# Altium project oldman.PrjPCB
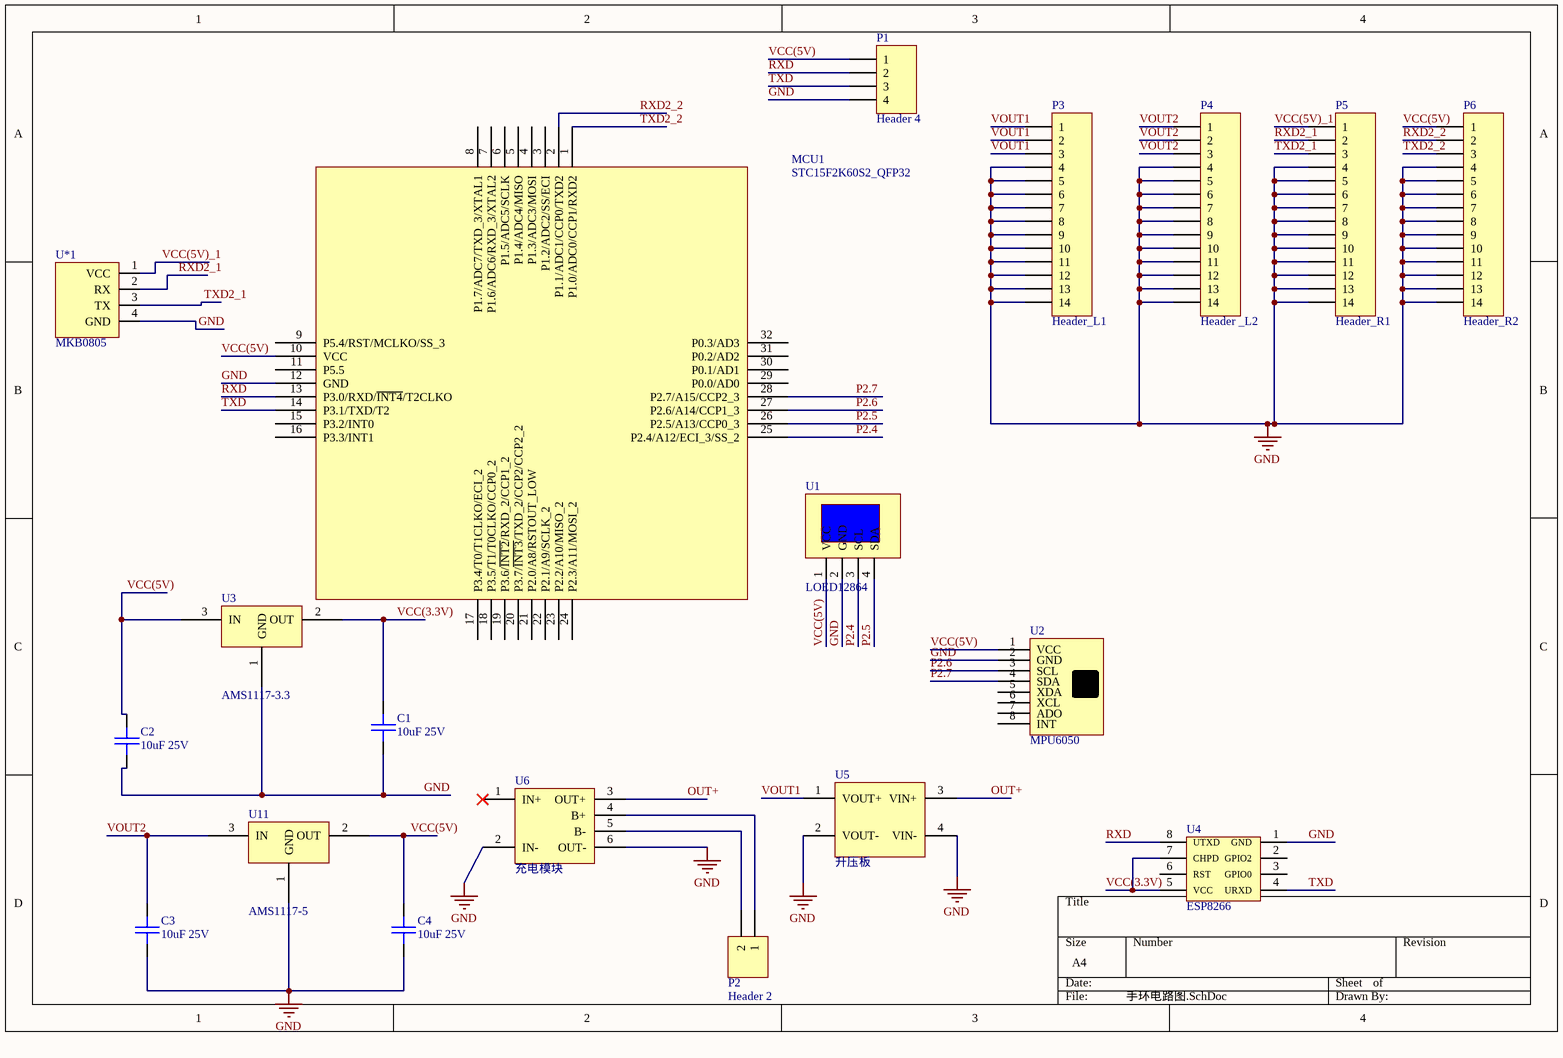
[diagram p0: 手环电路图.SchDoc]
1 sheet, 19 parts. Net scope: global (net labels, ports and power ports of the same name join across sheets).
Board file: oldman.PcbDoc

## Sheet 手环电路图.SchDoc
size A4

### Parts
C1  10uF 25V  [SMT_C_0805]
C2  10uF 25V  [SMT_C_0805]
C3  10uF 25V  [SMT_C_0805]
C4  10uF 25V  [SMT_C_0805]
MCU1  STC15F2K60S2_QFP32  [LQFP32]
P1  Header 4  [HDR1X4]
P2  Header 2  [HDR1X2]
P3  Header_L1  [HDR1X14]
P4  Header _L2  [HDR1X14]
P5  Header_R1  [HDR1X14]
P6  Header_R2  [HDR1X14]
U1  LOED12864  [OLED12864]
U2  MPU6050  [MPU6050]
U3  AMS1117-3.3  [AMS1117]
U4  ESP8266  [ESP8266]
U5  升压板  [MT3608]
U6  充电模块  [HW373]
U11  AMS1117-5  [AMS1117]
U*1  MKB0805  [MKB0805]

### Nets
GND: C1.2 C2.2 C3.2 C4.2 MCU1.12(GND) P1.4 P3.4 P3.5 P3.6 P3.7 P3.8 P3.9 P3.10 P3.11 P3.12 P3.13 P3.14 P4.4 P4.5 P4.6 P4.7 P4.8 P4.9 P4.10 P4.11 P4.12 P4.13 P4.14 P5.4 P5.5 P5.6 P5.7 P5.8 P5.9 P5.10 P5.11 P5.12 P5.13 P5.14 P6.4 P6.5 P6.6 P6.7 P6.8 P6.9 P6.10 P6.11 P6.12 P6.13 P6.14 U1.2(GND) U2.2(GND) U3.1(GND) U4.1(GND) U5.2(VOUT-) U5.4(VIN-) U6.2(IN-) U6.6(OUT-) U11.1(GND) U*1.4(GND)
OUT+: U5.3(VIN+) U6.3(OUT+)
P2.4: MCU1.25(P2.4/A12/ECI_3/SS_2) U1.3(SCL)
P2.5: MCU1.26(P2.5/A13/CCP0_3) U1.4(SDA)
P2.6: MCU1.27(P2.6/A14/CCP1_3) U2.3(SCL)
P2.7: MCU1.28(P2.7/A15/CCP2_3) U2.4(SDA)
RXD: MCU1.13(P3.0/RXD/~{INT4}/T2CLKO) P1.2 U4.8(UTXD)
RXD2_1: P5.2 U*1.2(RX)
RXD2_2: MCU1.2(P1.1/ADC1/CCP0/TXD2) P6.2
TXD: MCU1.14(P3.1/TXD/T2) P1.3 U4.4(URXD)
TXD2_1: P5.3 U*1.3(TX)
TXD2_2: MCU1.1(P1.0/ADC0/CCP1/RXD2) P6.3
VCC(3.3V): C1.1 U3.2(OUT) U4.5(VCC) U4.7(CHPD)
VCC(5V): C2.1 C4.1 MCU1.10(VCC) P1.1 P6.1 U1.1(VCC) U2.1(VCC) U3.3(IN) U11.2(OUT)
VCC(5V)_1: P5.1 U*1.1(VCC)
VOUT1: P3.1 P3.2 P3.3 U5.1(VOUT+)
VOUT2: C3.1 P4.1 P4.2 P4.3 U11.3(IN)
NetP2_1: P2.1 U6.4(B+)
NetP2_2: P2.2 U6.5(B-)

Not connected (* = marked no-connect by the designer): MCU1 3(P1.2/ADC2/SS/ECI) 4(P1.3/ADC3/MOSI) 5(P1.4/ADC4/MISO) 6(P1.5/ADC5/SCLK) 7(P1.6/ADC6/RXD_3/XTAL2) 8(P1.7/ADC7/TXD_3/XTAL1) 9(P5.4/RST/MCLKO/SS_3) 11(P5.5) 15(P3.2/INT0) 16(P3.3/INT1) 17(P3.4/T0/T1CLKO/ECI_2) 18(P3.5/T1/T0CLKO/CCP0_2) 19(P3.6/~{INT2}/RXD_2/CCP1_2) 20(P3.7/~{INT3}/TXD_2/CCP2/CCP2_2) 21(P2.0/A8/RSTOUT_LOW) 22(P2.1/A9/SCLK_2) 23(P2.2/A10/MISO_2) 24(P2.3/A11/MOSI_2) 29(P0.0/AD0) 30(P0.1/AD1) 31(P0.2/AD2) 32(P0.3/AD3); U2 5(XDA) 6(XCL) 7(ADO) 8(INT); U4 2(GPIO2) 3(GPIO0) 6(RST); U6 1(IN+)*

### Library data of the parts
C1-C4 = SMT_C_0805: Surface mount capacitor 0805
P1 = Header 4: Header, 4-Pin; LatestRevisionDate: 17-Jul-2002; LatestRevisionNote: Re-released for DXP Platform.; Publisher: Altium Limited
P2 = Header 2: Header, 2-Pin; LatestRevisionDate: 17-Jul-2002; LatestRevisionNote: Re-released for DXP Platform.; Publisher: Altium Limited
P3-P6 = Header 14: Header, 14-Pin; LatestRevisionDate: 17-Jul-2002; LatestRevisionNote: Re-released for DXP Platform.; Publisher: Altium Limited
U5 = MT3608
U6 = HW373
U11 = AMS1117-3.3